# EAGLE design PCB-AuxControl (EAGLE 9.5.2)
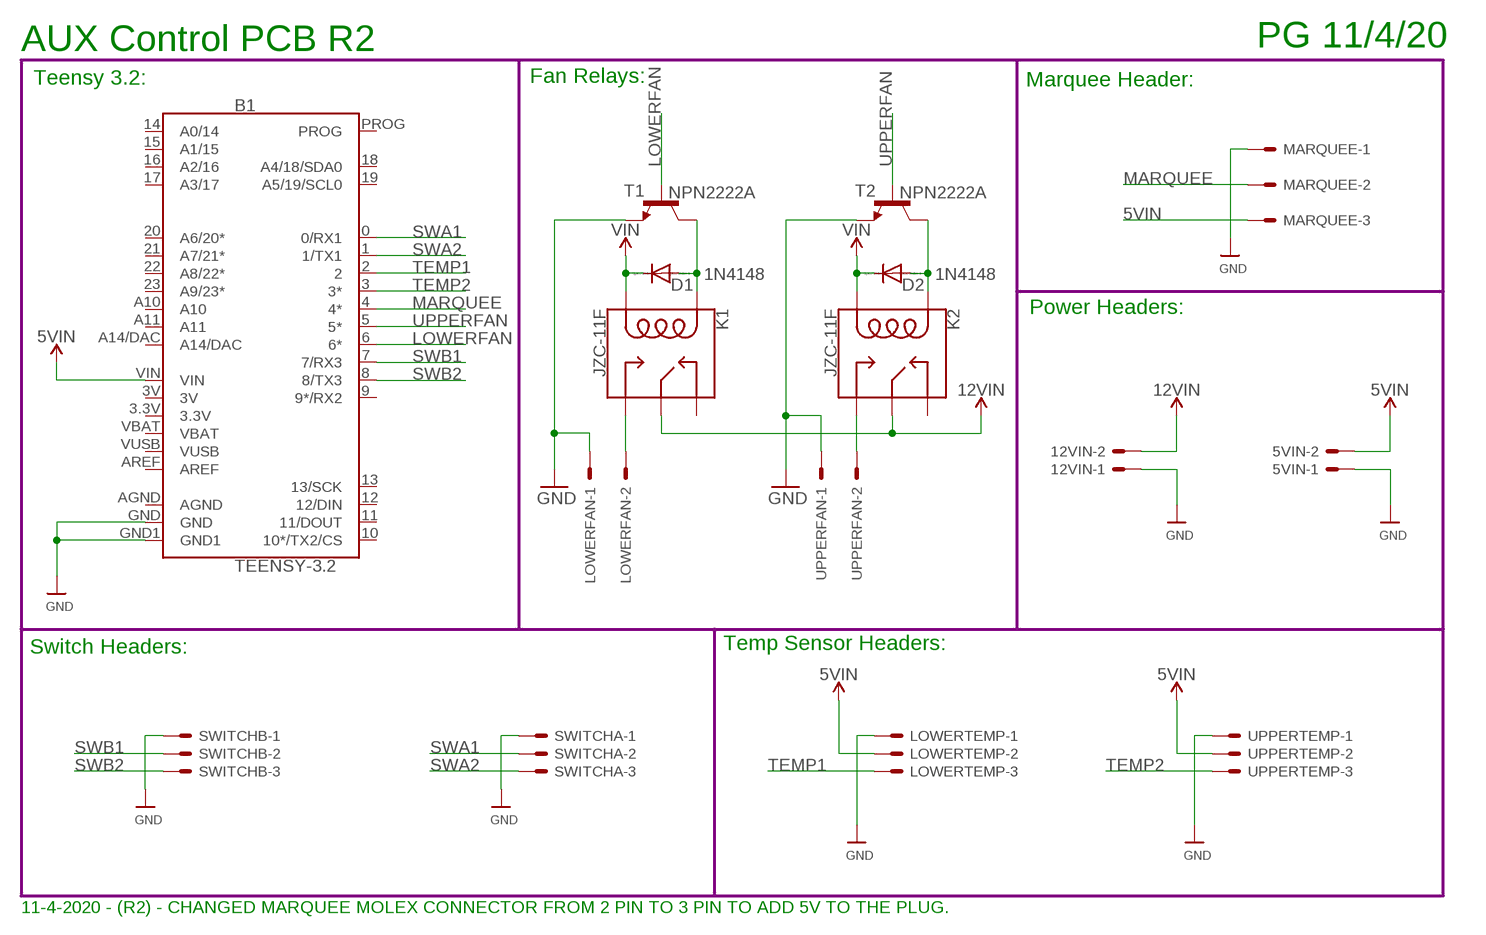
[diagram p0: schematic, sheet 1]

## Parts
5VIN  KK-156-2  [KK-156-2]
12VIN  KK-156-2  [KK-156-2]
B1  TEENSY-3.2  TEENSY-3.1SILK  [TEENSY-3.1]
D1  1N4148  1N4148DO35-7  [DO35-7]
D2  1N4148  1N4148DO35-7  [DO35-7]
K1  JZC-11F  RELAY-SPDT-JZC-11F  [RELAY-JZC]
K2  JZC-11F  RELAY-SPDT-JZC-11F  [RELAY-JZC]
LOWERFAN  KK-156-2  [KK-156-2]
LOWERTEMP  KK-156-3  [KK-156-3]
MARQUEE  KK-156-3  [KK-156-3]
SWITCHA  KK-156-3  [KK-156-3]
SWITCHB  KK-156-3  [KK-156-3]
T1  NPN2222A  BC337  [TO92]
T2  NPN2222A  BC337  [TO92]
UPPERFAN  KK-156-2  [KK-156-2]
UPPERTEMP  KK-156-3  [KK-156-3]

## Nets
5VIN: 5VIN.2 B1.VIN D1.C D2.C K1.1(COIL2) K2.1(COIL2) LOWERTEMP.2 MARQUEE.3 UPPERTEMP.2 ; supply symbol labelled VIN
12VIN: 12VIN.2 K1.4(MAIN) K2.4(MAIN)
GND: 5VIN.1 12VIN.1 B1.GND B1.GND1 LOWERFAN.1 LOWERTEMP.1 MARQUEE.1 SWITCHA.1 SWITCHB.1 T1.1(E) T2.1(E) UPPERFAN.1 UPPERTEMP.1
LOWERFAN: B1.6(6*) T1.2(B)
MARQUEE: B1.4(4*) MARQUEE.2
N$3: K2.3(NO) UPPERFAN.2
N$4: K1.3(NO) LOWERFAN.2
RELAY1: D1.A K1.5(COIL1) T1.3(C)
RELAY2: D2.A K2.5(COIL1) T2.3(C)
SWA1: B1.0(0/RX1) SWITCHA.2
SWA2: B1.1(1/TX1) SWITCHA.3
SWB1: B1.7(7/RX3) SWITCHB.2
SWB2: B1.8(8/TX3) SWITCHB.3
TEMP1: B1.2 LOWERTEMP.3
TEMP2: B1.3(3*) UPPERTEMP.3
UPPERFAN: B1.5(5*) T2.2(B)
Unconnected: B1.9(9*/RX2) B1.10(10*/TX2/CS) B1.11(11/DOUT) B1.12(12/DIN) B1.13(13/SCK) B1.14(A0/14) B1.15(A1/15) B1.16(A2/16) B1.17(A3/17) B1.18(A4/18/SDA0) B1.19(A5/19/SCL0) B1.20(A6/20*) B1.21(A7/21*) B1.22(A8/22*) B1.23(A9/23*) B1.A10 B1.A11 B1.A14/DAC B1.AREF B1.PROG K1.2(NC) K2.2(NC)

## Notes on the sheet
- AUX Control PCB R2 | PG 11/4/20
- Teensy 3.2: | Fan Relays: | Marquee Header:
- Power Headers:
- Switch Headers: | Temp Sensor Headers:
- 11-4-2020 - (R2) - CHANGED MARQUEE MOLEX CONNECTOR FROM 2 PIN TO 3 PIN TO ADD 5V TO THE PLUG.

## Power pins joined to a net without a drawn wire
3.3V: B1.3.3V
3V: B1.3V
AGND: B1.AGND
VBAT: B1.VBAT
VUSB: B1.VUSB

## Library data of the parts
5VIN 12VIN LOWERFAN UPPERFAN = con-molex:KK-156-2: KK 156 HEADER Source: http://www.molex.com/pdm_docs/sd/026604100_sd.pdf; MF: MOLEX; OC_FARNELL: unknown; OC_NEWARK: unknown
B1 = SparkFun-Boards:TEENSY-3.1: Teensy 3+ Footprint Mechanical footprint with connectors for Teensy Development Board with ARM Cortex. SparkFun Products: Teensy 3.2 <https://www.sparkfun.com/products/13736> Teensy LC <https://www.sparkfun.com/products/13305>; SF_ID: DEV-12646
D1 D2 = diode:1N4148: DIODE high speed (Philips)
K1 K2 = SparkFun-Electromechanical:RELAY-SPDT: SPDT Electromechanical Relay Single-pole, double-throw sealed relays. When current is applied to the coil, it throws a simple changeover switch, terminating the connection from the NC contact to ground and closing the NO contact. Use them to switch high voltage/high current devices. SparkFun Products JQX-15F: Relay SPDT Sealed - 20A <https://www.sparkfun.com/products/10924> (COM-10924) JZC-11F: Relay SPDT Sealed <https://www.sparkfun.com/products/100> (COM-00100); PROD_ID: COMP-09533; SF_SKU: COM-00100
LOWERTEMP MARQUEE SWITCHA SWITCHB UPPERTEMP = con-molex:KK-156-3: KK 156 HEADER Source: http://www.molex.com/pdm_docs/sd/026604100_sd.pdf; MF: MOLEX; OC_FARNELL: unknown; OC_NEWARK: unknown
T1 T2 = transistor:BC337: NPN TRANSISTOR

## Board
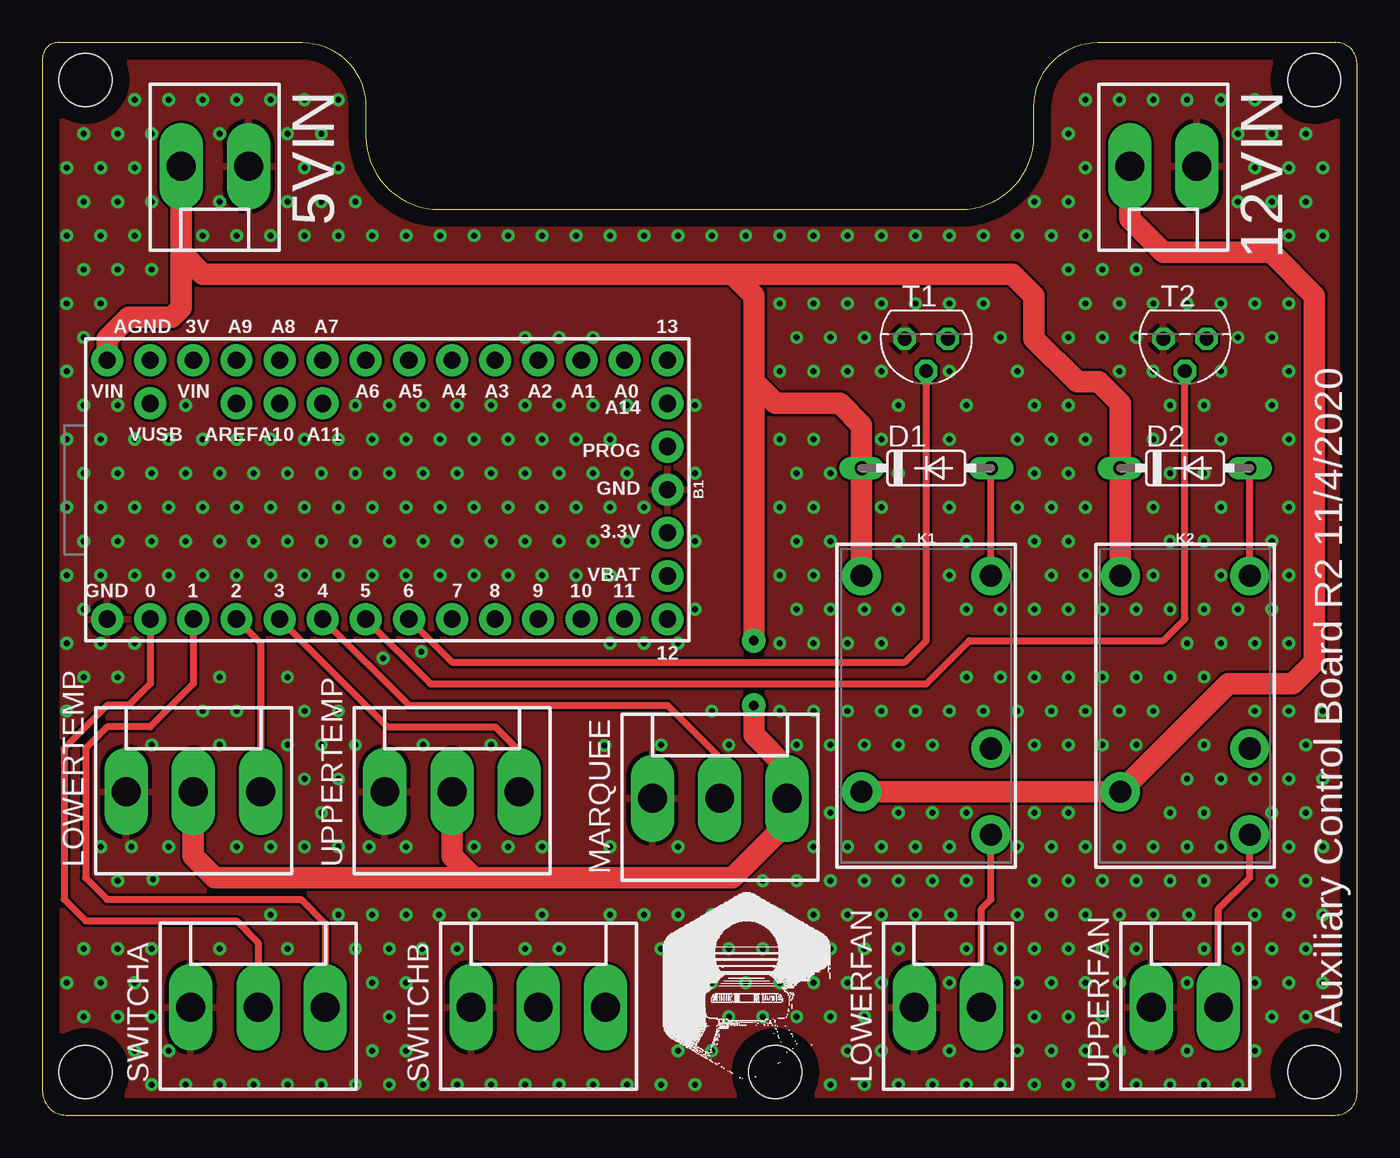
[diagram p1: board, top side]
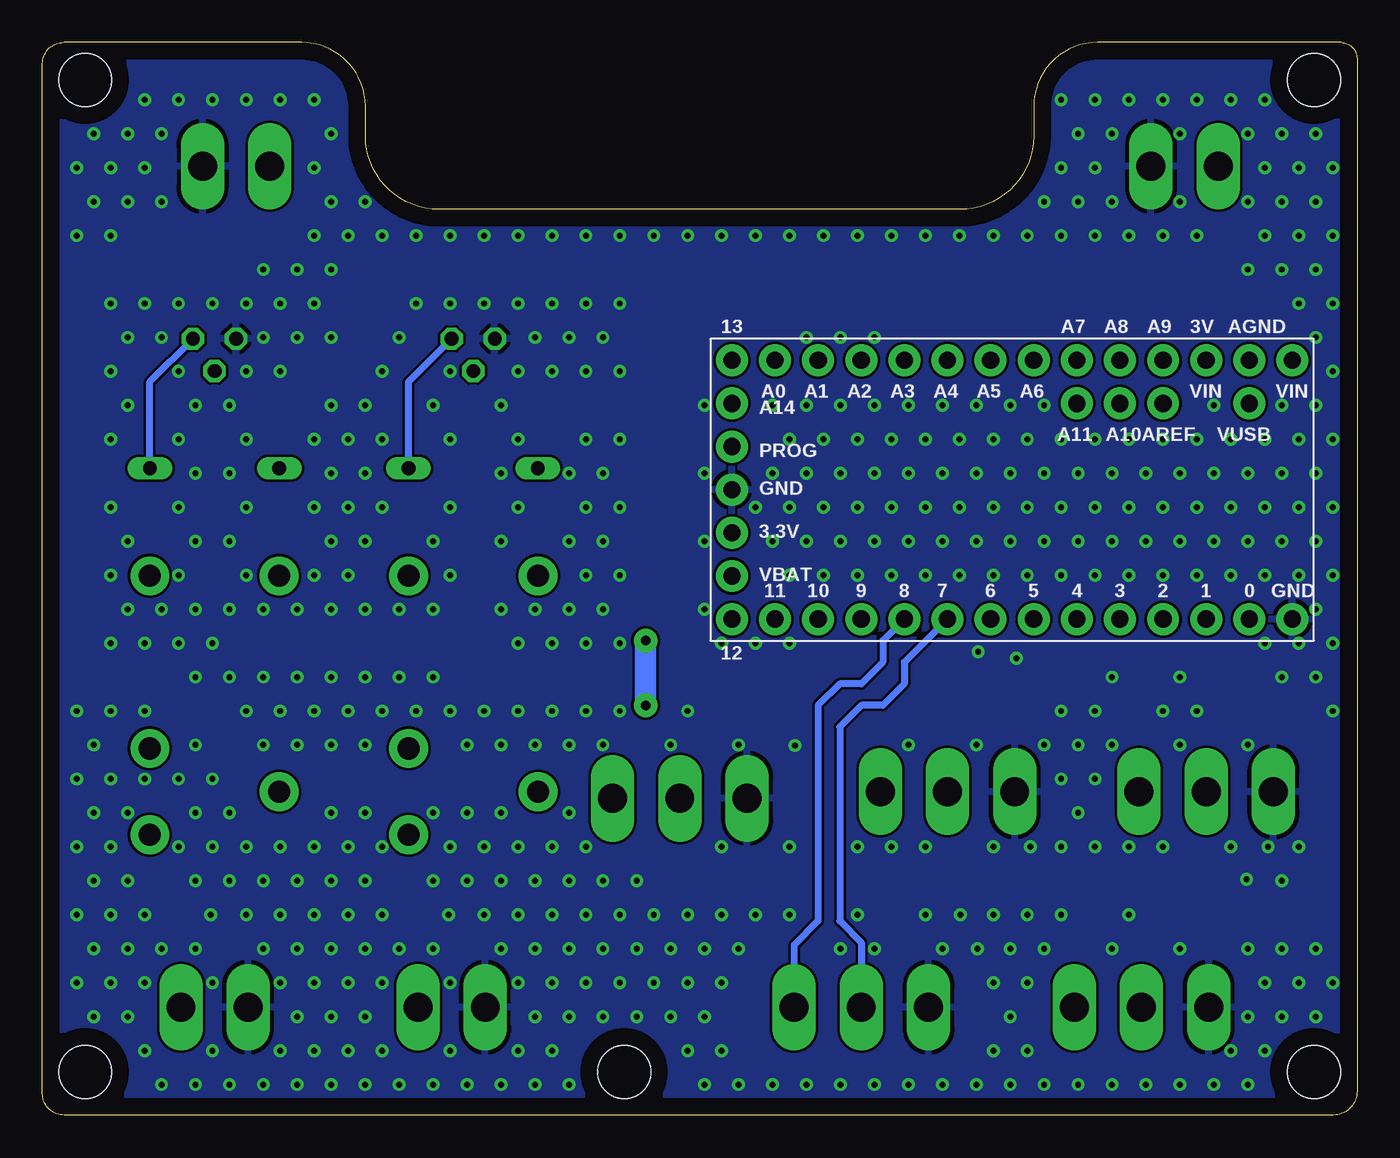
[diagram p2: board, bottom side, seen from below]

Size 77.45 x 63.17 mm. Coordinates in mm from the lower left corner, seen from the top.
Outline: 0,62.23 0,1.4 arc90 1.4,0 76.18,0 arc90 77.45,1.27 77.45,61.92 arc90 76.2,63.17 62.17,63.17 arc90 58.42,59.41 58.42,57.68 arc-90 54.08,53.34 23.39,53.34 arc-90 19.05,57.68 19.05,59.41 arc90 15.29,63.17 0.94,63.17 arc90 0,62.23
Copper layers (1*16): Top 0.035mm / dielectric 1.5mm / Bottom 0.035mm
Design rules "default": minimum track width 6mil, minimum drill 0.35mm, track to track 6mil, track to pad 6mil, pad to pad 6mil, via to via 6mil, smd to smd 6mil, copper to edge 40mil, drill to drill 6mil, minimum pad ring 10mil, minimum via ring 8mil, stop-mask expansion 4mil, vias tented up to drill 0.5mm, thermal gap 10mil
Holes 3.1 mm at 2.54,2.54 74.93,2.54 74.93,60.96 2.54,60.96 43.18,2.54

### Footprints (pad centres in the part's own frame; a part is rotated, then mirrored left to right if it is on the bottom)
KK-156-2 = drill 1.7 pad 2.184 long: 1 -1.98,0; 2 1.98,0
TEENSY-3.1 = drill 1.016 pad 1.88: 0 7.62,-13.97; 1 7.62,-11.43; 2 7.62,-8.89; 3 7.62,-6.35; 3.3V 2.54,16.51; 3V -7.62,-11.43; 4 7.62,-3.81; 5 7.62,-1.27; 6 7.62,1.27; 7 7.62,3.81; 8 7.62,6.35; 9 7.62,8.89; 10 7.62,11.43; 11 7.62,13.97; 12 7.62,16.51; 13 -7.62,16.51; 14 -7.62,13.97; 15 -7.62,11.43; 16 -7.62,8.89; 17 -7.62,6.35; 18 -7.62,3.81; 19 -7.62,1.27; 20 -7.62,-1.27; 21 -7.62,-3.81; 22 -7.62,-6.35; 23 -7.62,-8.89; A10 -5.08,-6.35; A11 -5.08,-3.81; A14/DAC -5.08,16.51; AGND -7.62,-13.97; AREF -5.08,-8.89; GND 0,16.51; GND1 7.62,-16.51; PROG -2.54,16.51; VBAT 5.08,16.51; VIN -7.62,-16.51; VUSB -5.08,-13.97
DO35-7 = drill 0.813 long: A 3.81,0; C -3.81,0
RELAY-JZC = drill 1.3 pad 2.286: 1 3.81,-8.89; 2 -3.81,1.27; 3 -3.81,6.35; 4 3.81,3.81; 5 -3.81,-8.89
KK-156-3 = drill 1.7 pad 2.184 long: 1 -3.96,0; 2 0,0; 3 3.96,0
TO92 = drill 0.813 octagon: 1 1.27,0; 2 0,1.905; 3 -1.27,0

### Placement (x,y rotation side)
5VIN  10.16,55.88 180 top
12VIN  66.04,55.88 180 top
B1  20.32,36.83 270 top
D1  52.07,38.1 0 top
D2  67.31,38.1 0 top
K1  52.07,22.86 180 top
K2  67.31,22.86 180 top
LOWERFAN  53.34,6.35 0 top
LOWERTEMP  8.89,19.05 0 top
MARQUEE  39.9,18.65 0 top
SWITCHA  12.7,6.35 0 top
SWITCHB  29.21,6.35 0 top
T1  52.07,45.72 180 top
T2  67.31,45.72 180 top
UPPERFAN  67.31,6.35 0 top
UPPERTEMP  24.13,19.05 0 top

### Tracks (layer width: path | path; a pad name or v marks a point on that pad's centre or on a via)
5VIN  (via drill 0.55 pad 1.4)
  Top 1.27: K2.1 D2.C 63.5,41.91 62.23,43.18 60.96,43.18 58.42,45.72 58.42,48.26 57.15,49.53 40.64,49.53 | K1.1 D1.C 48.26,40.64 46.99,41.91 43.18,41.91 41.91,43.18 | 25.4,13.97 40.64,13.97 43.86,17.19 MARQUEE.3 43.86,20.44 41.91,22.39 v41.91,24.13 | 25.4,13.97 10.16,13.97 8.89,15.24 LOWERTEMP.2 | 41.91,43.18 v41.91,27.94 | 40.64,49.53 41.91,48.26 41.91,43.18 | B1.VIN 3.81,45.72 5.08,46.99 7.62,46.99 8.18,47.55 8.18,50.8 | 5VIN.2 8.18,50.8 | 8.18,50.8 9.45,49.53 40.64,49.53 | UPPERTEMP.2 24.13,15.24 25.4,13.97
  Bottom 1.27: v41.91,27.94 v41.91,24.13
12VIN
  Top 1.27: K1.4 K2.4 69.85,25.4 73.66,25.4 74.93,26.67 74.93,48.26 72.39,50.8 66.04,50.8 64.06,52.78 12VIN.2
GND  (via drill 0.35)
  other vias: 2.44,5.8 1.44,7.8 2.44,9.8 1.44,23.8 2.44,25.8 1.44,27.8 2.44,29.8 1.44,31.8 2.44,33.8 1.44,35.8 2.44,37.8 1.44,39.8 2.44,41.8 1.44,43.8 2.44,45.8 1.44,47.8 2.44,49.8 1.44,51.8 2.44,53.8 1.44,55.8 2.44,57.8 4.44,5.8 3.44,7.8 4.44,9.8 4.44,13.8 3.44,15.8 4.44,25.8 3.44,27.8 3.44,31.8 4.44,33.8 3.44,35.8 4.44,37.8 3.44,39.8 4.44,41.8 3.44,47.8 4.44,49.8 3.44,51.8 4.44,53.8 3.44,55.8 4.44,57.8 6.44,1.8 5.44,3.8 6.44,5.8 5.44,7.8 6.44,9.8 6.44,21.8 5.44,27.8 5.44,31.8 6.44,33.8 5.44,35.8 6.44,37.8 5.44,39.8 6.44,49.8 5.44,51.8 6.44,53.8 5.44,55.8 6.44,57.8 5.44,59.8 8.44,1.8 7.44,3.8 7.44,15.8 7.44,31.8 8.44,33.8 7.44,35.8 8.44,37.8 7.44,39.8 8.44,41.8 7.44,59.8 10.44,1.8 10.44,9.8 5.24,15.8 10.44,21.8 9.44,23.8 10.44,25.8 9.44,31.8 10.44,33.8 9.44,35.8 10.44,37.8 9.44,39.8 9.44,51.8 10.44,53.8 10.44,57.8 9.44,59.8 12.44,1.8 11.44,15.8 11.44,23.8 11.44,31.8 12.44,33.8 11.44,35.8 12.44,37.8 11.44,39.8 11.44,51.8 11.44,59.8 14.44,1.8 14.44,9.8 13.44,11.8 13.44,15.8 14.44,21.8 14.44,25.8 13.44,31.8 14.44,33.8 13.44,35.8 14.44,37.8 13.44,39.8 13.44,51.8 14.44,53.8 14.44,57.8 13.44,59.8 16.44,1.8 15.44,15.8 16.44,17.8 15.44,19.8 16.44,21.8 15.44,23.8 15.44,31.8 16.44,33.8 15.44,35.8 16.44,37.8 15.44,39.8 15.44,51.8 16.44,53.8 15.44,55.8 16.44,57.8 15.44,59.8 18.44,1.8 18.44,9.8 17.44,11.8 17.44,15.8 17.44,19.8 18.44,21.8 17.44,23.8 17.44,31.8 18.44,33.8 17.44,35.8 18.44,37.8 17.44,39.8 18.44,41.8 17.44,51.8 18.44,53.8 17.44,55.8 17.44,59.8 20.44,1.8 19.44,3.8 20.44,5.8 19.44,7.8 20.44,9.8 19.44,11.8 20.07,26.91 19.44,31.8 20.44,33.8 19.44,35.8 20.44,37.8 19.44,39.8 20.44,41.8 19.44,51.8 22.44,1.8 21.44,3.8 21.44,7.8 21.44,11.8 21.44,15.8 22.44,21.8 22.32,27.29 21.44,31.8 22.44,33.8 21.44,35.8 22.44,37.8 21.44,39.8 22.44,41.8 21.44,51.8 24.44,1.8 24.44,9.8 19.24,15.8 23.44,31.8 24.44,33.8 23.44,35.8 24.44,37.8 23.44,39.8 24.44,41.8 23.44,51.8 26.44,1.8 6.51,13.89 22.37,9.8 25.44,11.8 25.44,15.8 26.44,21.8 25.44,31.8 26.44,33.8 25.44,35.8 26.44,37.8 25.44,39.8 26.44,41.8 25.44,51.8 28.44,1.8 28.44,9.8 23.37,11.8 27.44,15.8 27.44,31.8 28.44,33.8 27.44,35.8 28.44,37.8 27.44,39.8 28.44,41.8 28.44,45.8 27.44,51.8 30.44,1.8 30.44,9.8 29.44,11.8 29.44,15.8 29.44,31.8 30.44,33.8 29.44,35.8 30.44,37.8 29.44,39.8 30.44,41.8 30.44,45.8 29.44,51.8 32.44,1.8 31.44,31.8 32.44,33.8 31.44,35.8 32.44,37.8 31.44,39.8 32.44,41.8 32.44,45.8 31.44,51.8 34.44,1.8 33.44,11.8 33.44,15.8 33.44,27.8 33.44,31.8 34.44,33.8 33.44,35.8 34.44,37.8 33.44,39.8 34.44,41.8 33.44,51.8 36.44,1.8 36.44,9.8 35.44,11.8 36.44,21.8 35.44,27.8 35.44,35.8 35.44,51.8 38.44,1.8 37.44,3.8 38.44,5.8 37.44,7.8 38.44,9.8 37.44,11.8 37.44,15.8 33.12,21.76 37.44,27.8 38.44,29.8 38.44,33.8 38.44,37.8 38.44,41.8 37.44,51.8 39.44,3.8 40.44,5.8 39.44,7.8 40.44,9.8 39.44,11.8 40.44,21.8 39.44,23.8 39.44,51.8 42.44,5.8 41.44,7.8 42.44,9.8 41.44,11.8 42.44,13.8 41.44,51.8 44.44,5.8 43.44,7.8 44.44,9.8 43.44,11.8 44.44,13.8 44.44,21.8 43.44,23.8 43.44,27.8 44.44,29.8 43.44,31.8 44.44,33.8 43.44,35.8 44.44,37.8 43.44,39.8 43.44,43.8 44.44,45.8 43.44,47.8 43.44,51.8 46.44,1.8 46.44,5.8 45.44,7.8 46.44,9.8 45.44,11.8 46.44,13.8 45.44,15.8 46.44,17.8 46.44,21.8 45.44,23.8 45.44,27.8 46.44,29.8 45.44,31.8 46.44,33.8 45.44,35.8 46.44,37.8 45.44,39.8 45.44,43.8 46.44,45.8 45.44,47.8 45.44,51.8 48.44,1.8 47.44,3.8 48.44,5.8 47.44,7.8 48.44,9.8 47.44,11.8 48.44,13.8 47.44,15.8 48.44,21.8 47.44,23.8 47.44,27.8 48.44,29.8 47.44,43.8 48.44,45.8 47.44,47.8 47.44,51.8 50.44,1.8 49.44,3.8 49.44,7.8 50.44,9.8 49.44,11.8 50.44,13.8 49.44,15.8 50.44,17.8 50.44,21.8 49.44,23.8 49.44,27.8 50.44,29.8 50.44,33.8 49.44,35.8 50.44,37.8 49.44,39.8 50.44,41.8 49.44,43.8 49.44,47.8 49.44,51.8 52.44,1.8 51.44,11.8 52.44,13.8 51.44,15.8 52.44,17.8 52.44,21.8 51.44,23.8 51.44,47.8 51.44,51.8 54.44,1.8 53.44,3.8 53.44,7.8 54.44,9.8 54.44,13.8 53.44,15.8 54.44,17.8 53.44,23.8 54.44,25.8 54.44,29.8 53.44,31.8 54.44,33.8 53.44,35.8 53.44,39.8 54.44,41.8 53.44,43.8 53.44,47.8 53.44,51.8 56.44,1.8 56.44,9.8 53.53,11.8 55.44,23.8 56.44,25.8 56.44,29.8 56.44,45.8 55.44,47.8 55.44,51.8 58.44,1.8 57.44,3.8 58.44,5.8 57.44,7.8 58.44,9.8 57.44,11.8 58.44,13.8 57.44,15.8 58.44,17.8 58.44,21.8 57.44,23.8 58.44,25.8 58.44,29.8 58.44,33.8 57.44,35.8 58.44,37.8 57.44,39.8 58.44,41.8 57.44,43.8 57.44,51.8 58.44,53.8 60.44,1.8 59.44,3.8 60.44,5.8 59.44,7.8 60.44,9.8 59.44,11.8 60.44,13.8 59.44,15.8 60.44,17.8 60.44,21.8 59.44,23.8 60.44,25.8 60.44,29.8 59.44,31.8 60.44,33.8 59.44,35.8 60.44,37.8 59.44,39.8 60.44,41.8 60.44,45.8 60.44,49.8 59.44,51.8 60.44,53.8 60.44,57.8 62.44,1.8 61.44,3.8 62.44,5.8 61.44,7.8 62.44,9.8 61.44,11.8 62.44,13.8 61.44,15.8 62.44,21.8 61.44,23.8 62.44,25.8 62.44,29.8 61.44,31.8 61.44,35.8 61.44,39.8 62.44,45.8 61.44,47.8 62.44,49.8 61.44,51.8 61.44,55.8 61.44,59.8 64.44,1.8 63.44,3.8 63.44,7.8 64.44,9.8 63.44,11.8 64.44,13.8 63.44,15.8 64.44,21.8 63.44,23.8 64.44,25.8 64.44,29.8 63.44,43.8 64.44,45.8 63.44,47.8 64.44,49.8 63.44,59.8 66.44,1.8 65.44,11.8 66.44,13.8 65.44,15.8 66.44,17.8 65.44,23.8 66.44,25.8 66.44,29.8 65.44,31.8 66.44,33.8 65.44,35.8 66.44,37.8 65.44,39.8 66.44,41.8 65.44,43.8 65.44,47.8 65.44,59.8 68.44,1.8 67.44,3.8 67.44,7.8 68.44,9.8 68.44,13.8 67.44,15.8 68.44,17.8 67.44,19.8 68.44,21.8 68.44,25.8 67.44,27.8 68.44,29.8 68.44,33.8 68.44,37.8 68.44,41.8 67.44,47.8 67.44,59.8 70.44,1.8 70.44,9.8 67.53,11.8 69.44,15.8 69.44,19.8 69.44,27.8 70.44,29.8 69.44,31.8 69.44,35.8 69.44,39.8 69.44,43.8 70.44,45.8 69.44,47.8 70.44,53.8 70.44,57.8 69.44,59.8 71.44,3.8 72.44,5.8 71.44,7.8 72.44,9.8 71.44,11.8 72.44,13.8 72.44,17.8 71.44,19.8 71.44,23.8 71.44,27.8 72.44,29.8 72.44,33.8 72.44,41.8 72.44,45.8 71.44,47.8 72.44,53.8 71.44,55.8 72.44,57.8 71.44,59.8 74.44,5.8 73.44,7.8 74.44,9.8 73.44,11.8 74.44,13.8 73.44,15.8 74.44,17.8 73.44,19.8 74.44,21.8 73.44,23.8 73.44,27.8 73.44,31.8 73.44,35.8 73.44,39.8 73.44,43.8 73.44,47.8 73.44,51.8 74.44,53.8 73.44,55.8 74.44,57.8 75.44,7.8 75.44,11.8 75.44,15.8 75.44,19.8 75.44,23.8 75.44,51.8 75.44,55.8
  pour Top: 0,0 0,63.5 77.47,63.5 77.47,0
  pour Bottom: 0,0 0,63.5 77.47,63.5 77.47,0
LOWERFAN
  Top 0.406: B1.6 24.13,26.67 50.8,26.67 52.07,27.94 T1.2
MARQUEE
  Top 0.406: B1.4 21.59,24.13 36.83,24.13 39.9,21.06 MARQUEE.2
N$3
  Top 0.406: UPPERFAN.2 69.29,12.14 71.12,13.97 K2.3
N$4
  Top 0.406: LOWERFAN.2 55.32,12.14 55.88,12.7 K1.3
RELAY1
  Top 0.406: K1.5 D1.A
  Bottom 0.406: D1.A 55.88,43.18 T1.3
RELAY2
  Top 0.406: K2.5 D2.A
  Bottom 0.406: D2.A 71.12,43.18 T2.3
SWA1
  Top 0.406: B1.0 6.35,25.4 5.08,24.13 3.81,24.13 1.27,21.59 1.27,12.7 2.54,11.43 11.43,11.43 12.7,10.16 SWITCHA.2
SWA2
  Top 0.406: B1.1 8.89,25.4 6.35,22.86 3.81,22.86 2.54,21.59 2.54,13.97 3.81,12.7 15.24,12.7 16.66,11.28 SWITCHA.3
SWB1
  Bottom 0.406: B1.7 26.67,26.67 26.67,25.4 27.94,24.13 29.21,24.13 30.48,22.86 30.48,11.43 29.21,10.16 SWITCHB.2
SWB2
  Bottom 0.406: B1.8 27.94,27.94 27.94,26.67 29.21,25.4 30.48,25.4 31.75,24.13 31.75,11.43 33.17,10.01 SWITCHB.3
TEMP1
  Top 0.406: B1.2 12.85,27.79 LOWERTEMP.3
TEMP2
  Top 0.406: B1.3 20.32,22.86 26.67,22.86 27.94,21.59 27.94,20.47 28.09,20.32 UPPERTEMP.3
UPPERFAN
  Top 0.406: B1.5 22.86,25.4 52.07,25.4 54.61,27.94 66.04,27.94 67.31,29.21 T2.2

### Text on the board
tNames: Auxiliary Control Board R2 11/4/2020
Reference: 11-4-2020 - (R2) - CHANGED MARQUEE / MOLEX FROM 2 PIN TO 3 PIN TO ADD / 5V TO HEADER. 5VIN WAS CHANGED / FROM .8068 THICKNESS TO 1.27 FOR / ADDITIONAL POWER NEEDS